# Altium schematic sheet 12V_BuckConverter.SchDoc: 12V Buck Converter
size A4; Organization: University of Guelph; Address1: 50 Stone Rd. E.; Address2: Guelph, ON; Address3: Canada; DocumentNumber: 1; Revision: 0.1; SheetNumber: 1; SheetTotal: 1
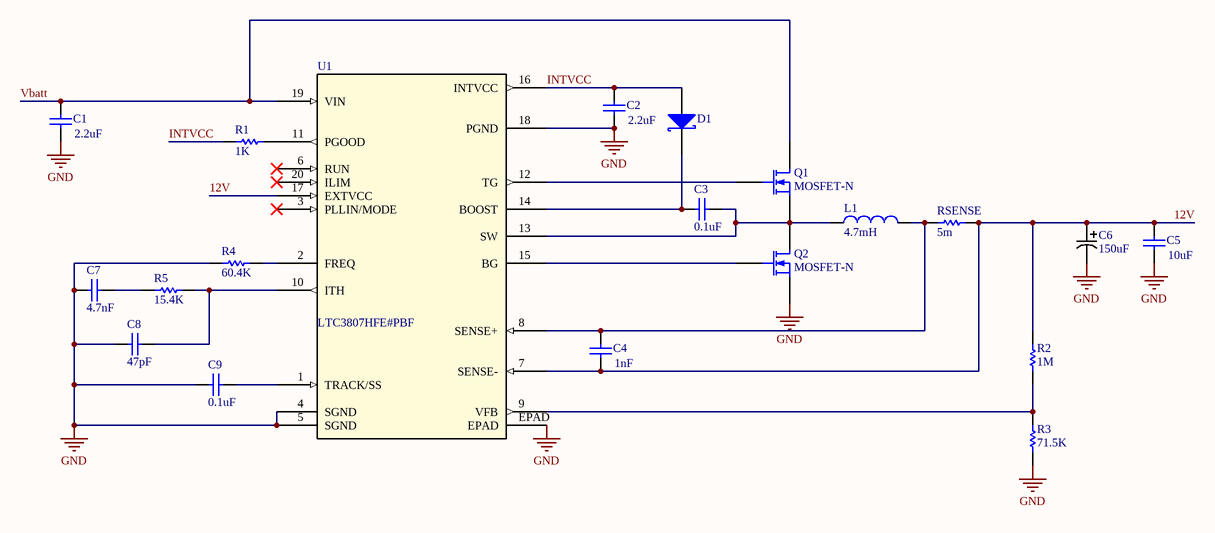
[diagram p0: 12V_BuckConverter.SchDoc]

## Parts
C1  value 2.2uF  [1206]  (hidden comment: Cap)
C2  value 2.2uF  [6-0805_N]  (hidden comment: Cap)
C3  value 0.1uF  [6-0805_N]  (hidden comment: Cap)
C4  value 1nF  [6-0805_N]  (hidden comment: Cap)
C5  value 10uF  [1206]  (hidden comment: Cap)
C6  150uF  [PCAP_SVP_F8]
C7  value 4.7nF  [6-0805_N]  (hidden comment: Cap)
C8  value 47pF  [6-0805_N]  (hidden comment: Cap)
C9  value 0.1uF  [6-0805_N]  (hidden comment: Cap)
D1  D Schottky  [DFLS1100]  (value not drawn)
L1  value 4.7mH  [WURTH 7443320470]  (hidden comment: Inductor)
Q1  MOSFET-N  [*SOT-669]
Q2  MOSFET-N  [*SOT-669]
R1  value 1K  [6-0805_N]  (hidden comment: Res1)
R2  value 1M  [6-0805_N]  (hidden comment: Res1)
R3  value 71.5K  [6-0805_N]  (hidden comment: Res1)
R4  value 60.4K  [6-0805_N]  (hidden comment: Res1)
R5  value 15.4K  [6-0805_N]  (hidden comment: Res1)
RSENSE  value 5m  [1206]  (hidden comment: Res1)
U1  LTC3807HFE#PBF  [TSSOP-20_FE/CB]

## Nets
GND: C1.1 C2.1 C5.1 C6.2 C7.2 C8.2 C9.2 Q2.3(S) R3.2 R4.2 U1.4(SGND) U1.5(SGND) U1.18(PGND) U1.EPAD
12V: C4.1 C5.2 C6.1 R2.1 RSENSE.1 U1.7(SENSE-) U1.17(EXTVCC)
INTVCC: C2.2 D1.1(A) R1.2 U1.16(INTVCC)
Vbatt: C1.2 Q1.1(D) U1.19(VIN)
NetC3_1: C3.1 L1.1 Q1.3(S) Q2.1(D) U1.13(SW)
NetC3_2: C3.2 D1.2(K) U1.14(BOOST)
NetC4_2: C4.2 L1.2 RSENSE.2 U1.8(SENSE+)
NetC7_1: C7.1 R5.2
NetC8_1: C8.1 R5.1 U1.10(ITH)
NetC9_1: C9.1 U1.1(TRACK/SS)
NetQ1_2: Q1.2(G) U1.12(TG)
NetQ2_2: Q2.2(G) U1.15(BG)
NetR1_1: R1.1 U1.11(PGOOD)
NetR2_2: R2.2 R3.1 U1.9(VFB)
NetR4_1: R4.1 U1.2(FREQ)

Not connected (* = marked no-connect by the designer): U1 3(PLLIN/MODE)* 6(RUN)* 20(ILIM)*

## Notes on the sheet
- Title
- Size:
- Date:
- A4
- Number:
- Time:
- Revision:
- Sheet
- of
- File:

## Library data of the parts
C1-C5 C7-C9 = Cap: Capacitor; Published: 8-Jun-2000; LatestRevisionDate: 17-Jul-2002; LatestRevisionNote: Re-released for DXP Platform.; PackageReference: RAD-0.3; Publisher: Altium Limited; PackageDescription: Radial Cap, Thru-Hole; 2 Leads; 0.3 in Pin Spacing
C6 = 16SVP150M: No Description Available; Vendor: Panasonic; Built_By: EMA_UL_Team; Type: DEV; Manufacturer_Part_Number: 16SVP150M; Copyright: Copyright (C) 2018 Accelerated Designs. All rights reserved; RefDes: RefDes; Value: Value
D1 = D Schottky: Schottky Diode; pin to pad: 1>A 2>K; Published: 8-Jun-2000; LatestRevisionDate: 17-Jul-2002; LatestRevisionNote: Re-released for DXP Platform.; PackageReference: SMB; Publisher: Altium Limited; PackageDescription: DO-214-AA/SMB; 2 C-Bend Leads; Body 5.3 x 3.6 mm, inc. leads (LxW); Code_JEDEC: DO-214-AA
L1 = Inductor: Code_IEC: 1005; Published: 8-Jun-2000; LatestRevisionDate: 29-May-2009; LatestRevisionNote: IPC-7351 Footprint Added.; PackageReference: 0402-A; Publisher: Altium Limited; PackageDescription: Chip Inductor; Code_JEITA: 0402
Q1 Q2 = MOSFET-N: N-Channel MOSFET; pin to pad: 1>3 3>1; Published: 8-Jun-2000; LatestRevisionDate: 17-Jul-2002; LatestRevisionNote: Re-released for DXP Platform.; PackageVersion: 1995/1996; PackageReference: E3; Publisher: Altium Limited; PackageDescription: TO, Flat Index; 3 In-Line, Axial Leads; Body Dia. 4.6mm; Lead Dia. 0.5 mm (max)
R1-R5 RSENSE = Res1: Resistor; Published: 8-Jun-2000; LatestRevisionDate: 17-Jul-2002; LatestRevisionNote: Re-released for DXP Platform.; PackageReference: AXIAL-0.3; Publisher: Altium Limited; PackageDescription: Axial Device, Thru-Hole; 2 Leads; 0.3 in Pin Spacing
U1 = LTC3807HFE#PBF: No Description Available; Vendor: Linear Technology; Built_By: EMA_UL_Team; Manufacturer_Part_Number: LTC3807HFE#PBF; Copyright: Copyright (C) 2018 Accelerated Designs. All rights reserved; RefDes: RefDes; Type: DEV; Value: Value